# EAGLE design SMD (EAGLE 8.0.1)
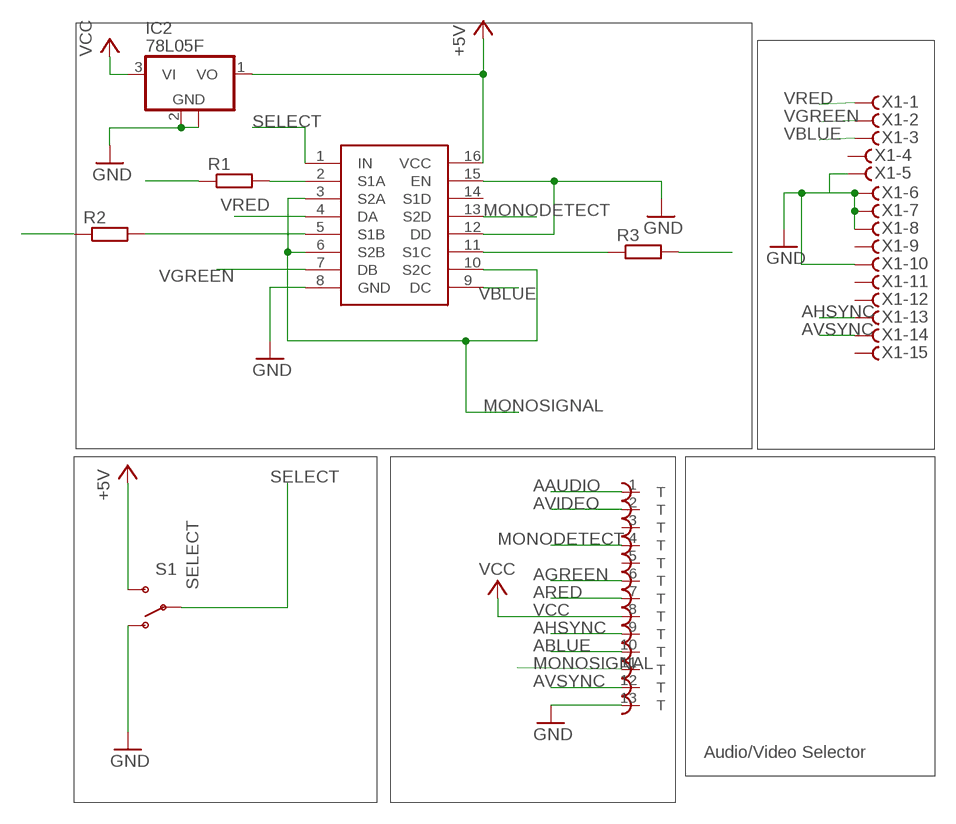
[diagram p0: schematic, sheet 1]

## Parts
ATARIOUT  DIN13T  [ADADS]
IC2  78L05F  [SOT89]
R1  R-EU_R1206  [R1206]
R2  R-EU_R1206  [R1206]
R3  R-EU_R1206  [R1206]
S1  SWITCH-SPDT-SMD-A  [SWITCH-SPST-SMD-A]
TS5V330  V330  [SOIC16N]
X1  F15HDVS  [HDF15V]

## Nets
+5V: IC2.1(VO) S1.3(S) TS5V330.16(VCC)
AAUDIO: ATARIOUT.1
ABLUE: ATARIOUT.10 R3.2
AGREEN: ATARIOUT.6 R2.1
AHSYNC: ATARIOUT.9 X1.13
ARED: ATARIOUT.7 R1.1
AVIDEO: ATARIOUT.2
AVSYNC: ATARIOUT.12 X1.14
BOUT: R3.1 TS5V330.11(S1C)
GND: ATARIOUT.13 IC2.2(GND) IC2.2@1(GND) S1.1(O) TS5V330.8(GND) TS5V330.12(DD) TS5V330.15(EN) X1.5 X1.6 X1.7 X1.8 X1.10
GOUT: R2.2 TS5V330.5(S1B)
MONODETECT: ATARIOUT.4 TS5V330.13(S2D)
MONOSIGNAL: ATARIOUT.11 TS5V330.3(S2A) TS5V330.6(S2B) TS5V330.10(S2C)
ROUT: R1.2 TS5V330.2(S1A)
SELECT: S1.2(P) TS5V330.1(IN)
VBLUE: TS5V330.9(DC) X1.3
VCC: ATARIOUT.8 IC2.3(VI)
VGREEN: TS5V330.7(DB) X1.2
VRED: TS5V330.4(DA) X1.1
Unconnected: ATARIOUT.3 ATARIOUT.5 TS5V330.14(S1D) X1.4 X1.9 X1.11 X1.12 X1.15

## Notes on the sheet
- Audio/Video Selector

## Library data of the parts
ATARIOUT = ube:DIN13
IC2 = linear:78L*: POSITOIV-VOLTAGE REGULATORS Output up to 100 mA Source: Datasheet <http://focus.ti.com/lit/ds/symlink/ua78l05.pdf>
R1-R3 = resistor:R-EU_: RESISTOR, European symbol
S1 = SparkFun-Electromechanical:SWITCH-SPDT: SPDT Switch Simple slide switch, Spark Fun Electronics SKU : COM-00102 DPDT SMT slide switch, AYZ0202, SWCH-08179; PROD_ID: SWCH-10651
TS5V330 = ube:V330
X1 = con-subd:F15?S: SUB-D; OC_FARNELL: unknown; OC_NEWARK: unknown

## Net classes
0 default: width 0.254 mm

## Board
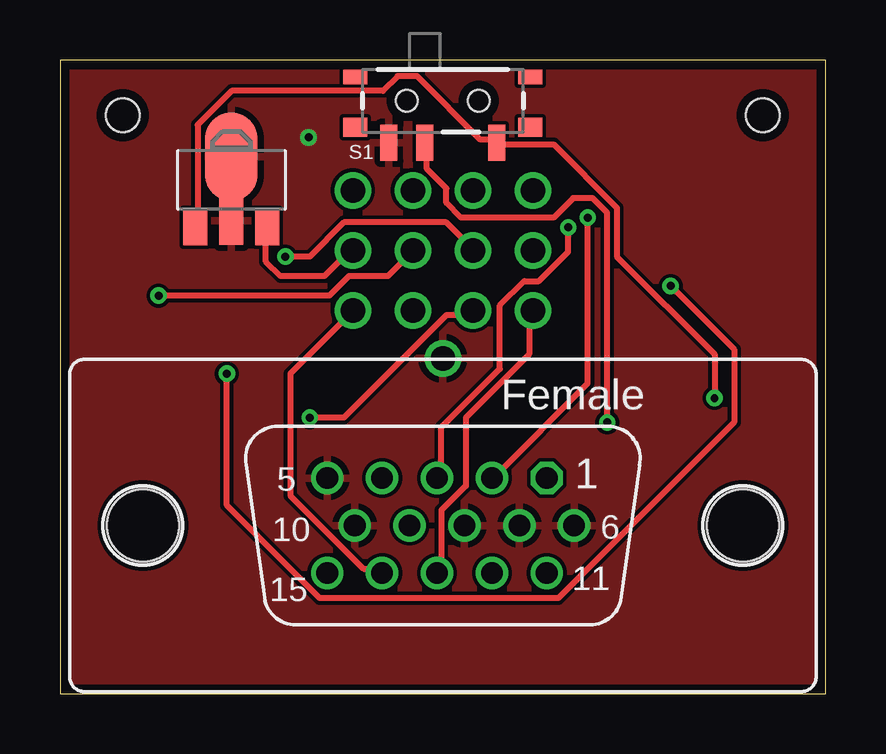
[diagram p1: board, top side]
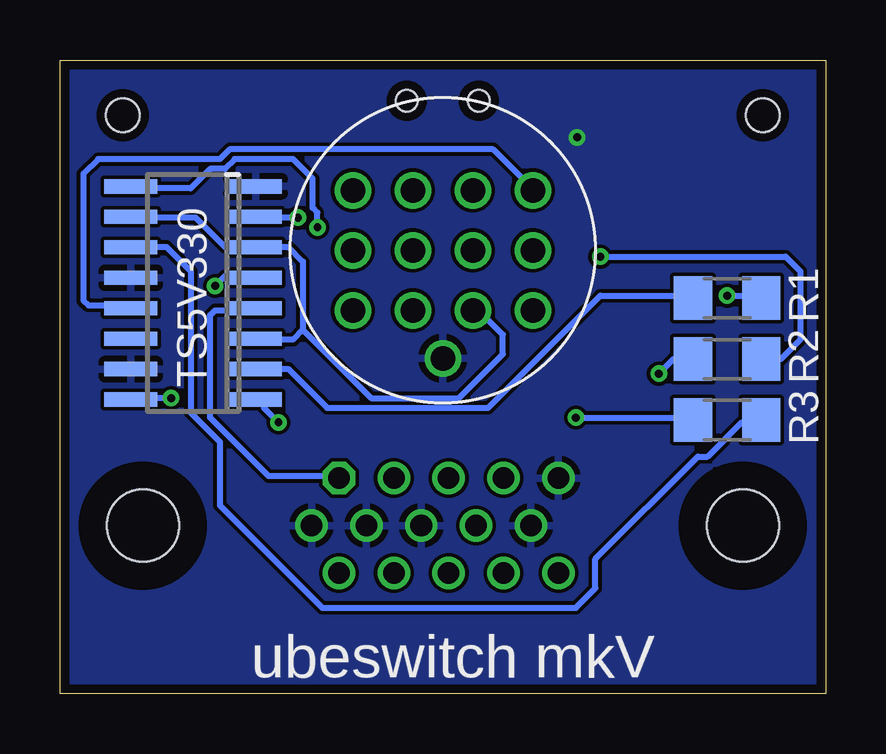
[diagram p2: board, bottom side, seen from below]

Size 31.9 x 26.4 mm. Coordinates in mm from the lower left corner, seen from the top.
Outline: 0,0 31.9,0 31.9,26.4 0,26.4 0,0
Copper layers (1*16): Top 0.0356mm / dielectric 1.5011mm / Bottom 0.0356mm
Design rules "PCBs_io": minimum track width 6mil, minimum drill 13mil, track to track 6mil, track to pad 6mil, pad to pad 6mil, via to via 6mil, smd to smd 6mil, copper to edge 15mil, drill to drill 6mil, minimum pad ring 7mil, minimum via ring 7mil, stop-mask expansion 3mil, vias tented up to drill 0mil, thermal gap 10mil
Holes 1.4 mm at 2.62,24.1 29.29,24.1

### Footprints (pad centres in the part's own frame; a part is rotated, then mirrored left to right if it is on the bottom)
ADADS = drill 1.016: 1 -3.75,2.5; 2 -1.25,2.5; 3 1.25,2.5; 4 3.75,2.5; 5 -3.75,0; 6 -1.25,0; 7 1.25,0; 8 3.75,0; 9 -3.75,-2.5; 10 -1.25,-2.5; 11 1.25,-2.5; 12 3.75,-2.5; 13 0,-4.5
SOT89 = smd 1 x 1.5: 1 -1.499,-1.981; 3 1.499,-1.981 | smd 1 x 2: 2 0,-1.727 | smd 2.2 x 3.7: 2@1 0,0.94
R1206 = smd 1.6 x 1.803: 1 -1.422,0; 2 1.422,0
SWITCH-SPST-SMD-A = smd 0.7 x 1.5: 1 -2.25,-1.75; 2 -0.75,-1.75; 3 2.25,-1.75 | smd 1 x 0.6: GND1 -3.65,1; GND3 3.65,1 | smd 1 x 0.8: GND2 -3.65,-1.1; GND4 3.65,-1.1 | hole 0.9: -1.5,0; 1.5,0
SOIC16N = smd 0.6 x 2.2: 1 -4.445,-2.6; 2 -3.175,-2.6; 3 -1.905,-2.6; 4 -0.635,-2.6; 5 0.635,-2.6; 6 1.905,-2.6; 7 3.175,-2.6; 8 4.445,-2.6; 9 4.445,2.6; 10 3.175,2.6; 11 1.905,2.6; 12 0.635,2.6; 13 -0.635,2.6; 14 -1.905,2.6; 15 -3.175,2.6; 16 -4.445,2.6
HDF15V = drill 0.9 octagon: 1 4.329,1.98 | drill 0.9: 2 2.043,1.98; 3 -0.243,1.98; 4 -2.529,1.98; 5 -4.815,1.98; 6 5.472,0; 7 3.186,0; 8 0.9,0; 9 -1.386,0; 10 -3.672,0; 11 4.329,-1.98; 12 2.043,-1.98; 13 -0.243,-1.98; 14 -2.529,-1.98; 15 -4.815,-1.98 | hole 3: -12.5,0; 12.5,0

### Placement (x,y rotation side)
ATARIOUT  15.95,18.47 0 bottom
IC2  7.14,21.42 0 top
R1  4.11,16.48 180 bottom
R2  4.11,13.94 180 bottom
R3  4.11,11.4 180 bottom
S1  15.95,24.7 0 top
TS5V330  26.36,16.69 90 bottom
X1  15.95,7 0 top

### Tracks (layer width: path | path; a pad name or v marks a point on that pad's centre or on a via)
+5V  (via drill 0.33)
  Top 0.254: IC2.1 5.73,19.63 5.73,23.69 7.16,25.12 13.45,25.12 14.06,25.73 14.88,25.73 17.52,23.08 18.13,23.08 S1.3 18.33,22.88 20.57,22.88 23.21,20.24 23.21,18.21 27.27,14.14 v27.27,12.31
  Bottom 0.254: v27.27,12.31 28.9,12.31 TS5V330.16
ABLUE  (via drill 0.33)
  Top 0.254: v10.41,11.5 11.83,11.5 16.1,15.77 17.11,15.77 ATARIOUT.10
  Bottom 0.254: v10.41,11.5 5.53,11.5 R3.2
AGREEN  (via drill 0.33)
  Top 0.254: v9.39,18.21 10.41,18.21 11.83,19.63 16.1,19.63 17.11,18.61 ATARIOUT.6
  Bottom 0.254: R2.1 1.87,13.94 1.06,14.75 1.06,17.6 1.67,18.21 v9.39,18.21
AHSYNC
  Top 0.254: X1.13 15.89,5.2 15.89,7.64 16.91,8.66 16.91,11.5 19.55,14.14 19.55,15.77 ATARIOUT.9
ARED  (via drill 0.33)
  Top 0.254: v4.11,16.58 11.22,16.58 12.03,17.39 13.66,17.39 14.67,18.41 ATARIOUT.7
  Bottom 0.254: v4.11,16.58 2.89,16.58 R1.1
AVSYNC
  Top 0.254: X1.14 13.25,5.2 12.64,5.2 9.59,8.25 9.59,13.33 12.03,15.77 ATARIOUT.12
BOUT
  Bottom 0.254: R3.1 2.89,11.3 3.5,11.3 4.92,9.88 5.33,9.88 9.59,5.61 9.59,4.39 10.41,3.58 20.97,3.58 25.24,7.84 25.24,10.49 26.46,11.71 26.46,17.6 27.48,18.61 28.9,18.61 TS5V330.11
GND  (via drill 0.33)
  other vias: 10.36,23.18
  pour Bottom: 0.3,26.64 32.05,26.64 32.05,-0.03 0.3,-0.03
  pour Top: 0.3,26.64 32.05,26.64 32.05,-0.03 0.3,-0.03
GOUT  (via drill 0.33)
  Top 0.254: v6.95,13.33 6.95,7.84 10.81,3.98 20.77,3.98 28.09,11.3 28.09,14.35 v25.44,16.99
  Bottom 0.254: R2.2 6.34,13.94 v6.95,13.33 | v25.44,16.99 25.04,17.39 23.82,17.39 TS5V330.5
MONODETECT
  Bottom 0.254: TS5V330.13 29.1,16.18 30.73,16.18 30.93,16.38 30.93,21.66 30.32,22.27 25.24,22.27 24.83,22.68 13.86,22.68 12.24,21.05 ATARIOUT.4
MONOSIGNAL
  Bottom 0.254: 21.79,15.16 22.19,14.75 23.61,14.75 TS5V330.3 | 21.79,15.16 21.79,18 22.4,18.61 23.61,18.61 TS5V330.6 23.82,18.61 25.04,18.61 26.26,19.83 28.9,19.83 TS5V330.10 | 21.79,15.16 18.94,12.31 15.28,12.31 13.45,14.14 13.45,14.96 14.27,15.77 14.67,15.77 ATARIOUT.11
ROUT
  Bottom 0.254: R1.2 5.53,16.58 9.39,16.58 14.06,11.91 20.77,11.91 22.4,13.53 23.61,13.53 TS5V330.2
SELECT  (via drill 0.33)
  Top 0.254: v22.8,11.3 22.8,20.04 22.19,20.65 21.38,20.65 20.57,19.83 16.71,19.83 16.1,20.44 16.1,21.05 15.28,21.86 15.28,22.88 S1.2
  Bottom 0.254: v22.8,11.3 23.41,11.91 23.41,12.11 23.61,12.31 TS5V330.1
VBLUE  (via drill 0.33)
  Top 0.254: v21.18,19.43 21.18,18.41 19.96,17.19 19.35,17.19 18.33,16.18 18.33,13.53 15.89,11.09 15.89,9.06 X1.3
  Bottom 0.254: v21.18,19.43 21.18,20.04 21.38,20.24 21.38,21.46 22.19,22.27 24.63,22.27 25.04,21.86 25.65,21.86 26.46,21.05 28.9,21.05 TS5V330.9
VCC
  Top 0.254: IC2.3 8.58,19.43 8.58,18 9.19,17.39 11.02,17.39 12.03,18.41 ATARIOUT.8
VGREEN  (via drill 0.33)
  Top 0.254: v21.99,19.83 21.99,12.92 18.13,9.06 X1.2
  Bottom 0.254: v21.99,19.83 23.61,19.83 TS5V330.7
VRED
  Bottom 0.254: TS5V330.4 23.82,15.97 25.44,15.97 25.65,15.77 25.65,11.5 23.21,9.06 20.36,9.06 X1.1

### Text on the board
bNames: ubeswitch mkV